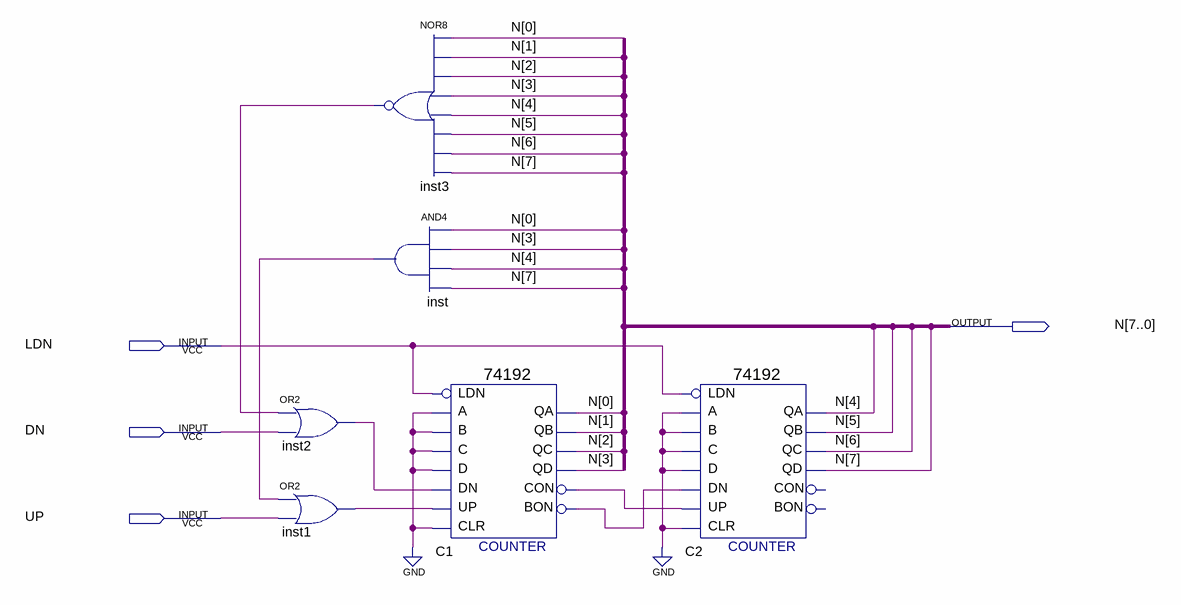
[diagram p0: schematic sheet]
// Quartus schematic contador_99.bdf as structural Verilog: 6 symbols, 4 pins
module contador_99 (
  input  LDN,
  input  DN,
  input  UP,
  output [7:0] N
);

  wire C1_bon, C1_con, inst1_out, inst2_out, inst3_out, inst_out;

  or inst2 (inst2_out, inst3_out, DN);
  or inst1 (inst1_out, inst_out, UP);
  nor inst3 (inst3_out, N[0], N[1], N[2], N[3], N[4], N[5], N[6], N[7]);
  and inst (inst_out, N[0], N[3], N[4], N[7]);
  \74192  C1 (
    .D(1'b0), .C(1'b0), .A(1'b0), .B(1'b0), .CLR(1'b0), .UP(inst1_out), .DN(inst2_out), .LDN(LDN), .QB(N[1]),
    .BON(C1_bon), .CON(C1_con), .QA(N[0]), .QC(N[2]), .QD(N[3]));
  \74192  C2 (
    .D(1'b0), .C(1'b0), .A(1'b0), .B(1'b0), .CLR(1'b0), .UP(C1_con), .DN(C1_bon), .LDN(LDN), .QB(N[5]),
    .QA(N[4]), .QC(N[6]), .QD(N[7]));  // open: BON, CON
endmodule
